# EAGLE schematic Microcontroller PCB (EAGLE 9.6.2)
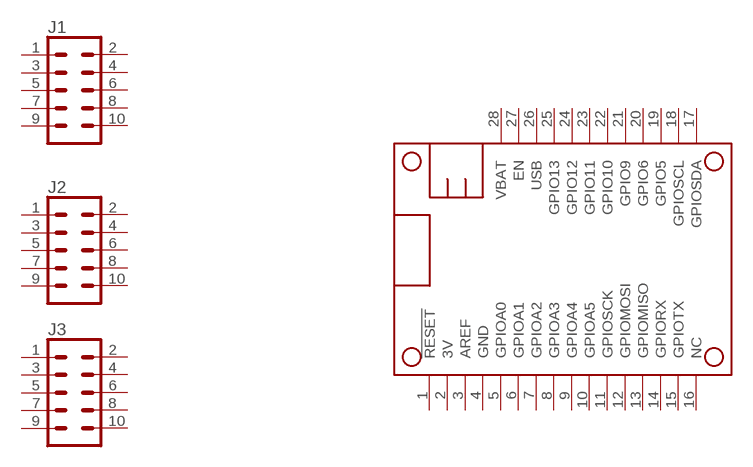
[diagram p0: schematic, sheet 1]

## Parts
J1  CONN_05X2NO_SILK  [2X5_NOSILK]
J2  CONN_05X2NO_SILK  [2X5_NOSILK]
J3  CONN_05X2NO_SILK  [2X5_NOSILK]
MS1  FEATHERWING_NODIM  [FEATHERWING_DIM]
Unconnected: J1.1 J1.2 J1.3 J1.4 J1.5 J1.6 J1.7 J1.8 J1.9 J1.10 J2.1 J2.2 J2.3 J2.4 J2.5 J2.6 J2.7 J2.8 J2.9 J2.10 J3.1 J3.2 J3.3 J3.4 J3.5 J3.6 J3.7 J3.8 J3.9 J3.10 MS1.1(!RESET) MS1.2(3V) MS1.3(AREF) MS1.5(GPIOA0) MS1.6(GPIOA1) MS1.7(GPIOA2) MS1.8(GPIOA3) MS1.9(GPIOA4) MS1.10(GPIOA5) MS1.11(GPIOSCK) MS1.12(GPIOMOSI) MS1.13(GPIOMISO) MS1.14(GPIORX) MS1.15(GPIOTX) MS1.16(NC) MS1.17(GPIOSDA) MS1.18(GPIOSCL) MS1.19(GPIO5) MS1.20(GPIO6) MS1.21(GPIO9) MS1.22(GPIO10) MS1.23(GPIO11) MS1.24(GPIO12) MS1.25(GPIO13) MS1.26(USB) MS1.27(EN) MS1.28(VBAT)

## Power pins joined to a net without a drawn wire
GND: MS1.4(GND)

## Library data of the parts
J1-J3 = SparkFun-Connectors:CONN_05X2: Multi connection point. Often used as Generic Header-pin footprint for 0.1 inch spaced/style header connections For AVR SPI programming port, see special device with nice symbol: "AVR_SPI_PROG_5x2.dev" You can populate with any combo of single row headers, but if you'd like an exact match, check these: 2x5 AVR ICSP Male Header <https://www.sparkfun.com/products/778> (PRT-00778) 2x5 Pin Shrouded Header <https://www.sparkfun.com/products/8506> (PRT-08506) On any of the 0.1 inch spaced packages, you can populate with these: Break Away Headers - Straight <https://www.sparkfun.com/products/116> (PRT-00116) Break Away Male Headers - Right Angle <https://www.sparkfun.com/products/553> (PRT-00553) Female Headers <https://www.sparkfun.com/products/115> (PRT-00115) Break Away Headers - Machine Pin <https://www.sparkfun.com/products/117> (PRT-00117) Break Away Female Headers - Swiss Machine Pin <https://www.sparkfun.com/products/743> (PRT-00743) Special note: the shrouded connector mates well with our 5x2 ribbon cables: 2x5 Pin IDC Ribbon Cable <https://www.sparkfun.com/products/8535> (PRT-08535)
MS1 = adafruit:FEATHERWING